# EasyEDA Pro project OpenWear Core.epro

# Schematic Schematic

## Sheets
1 Main: Create Date: 2023-09-01; Page Name: Main; Project Name: OpenWear; Schematic Name: Schematic; Update Date: 2023-11-01; Company: Zhejiang University; Drawed: AnxiousOrange; Page Size: A4; Version: V1.0
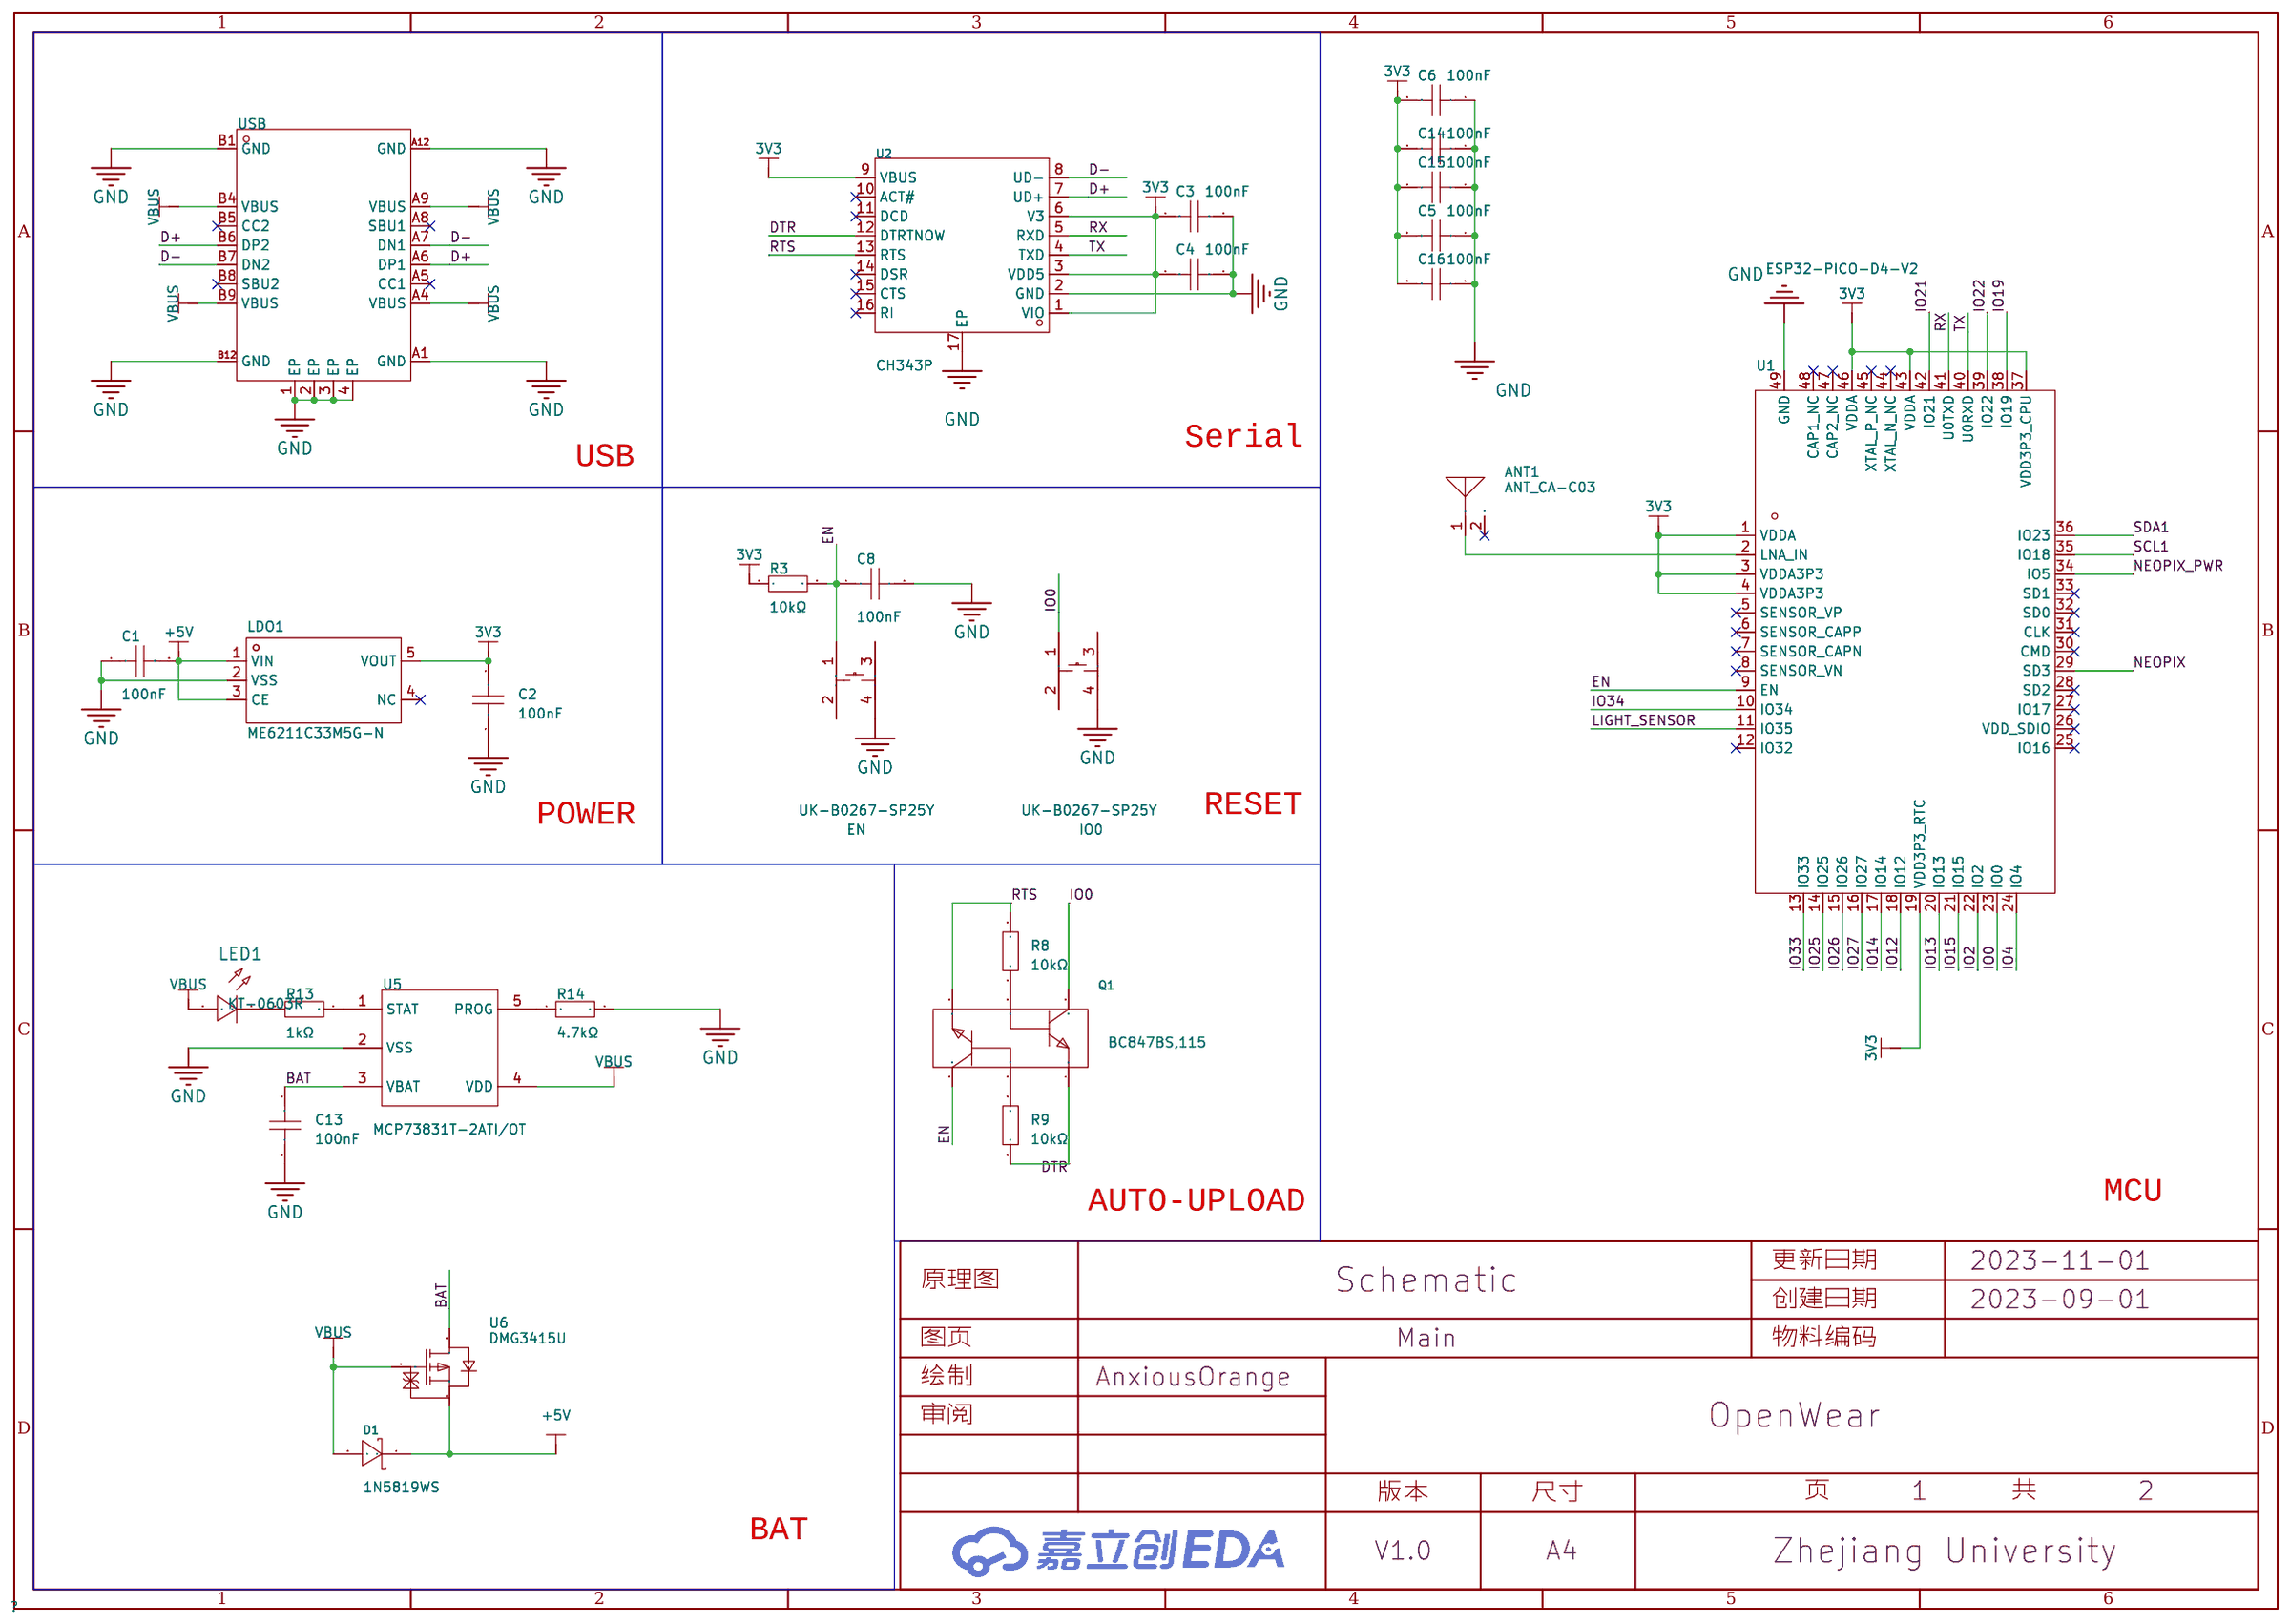
[diagram p0: Main]
2 Sensor: Create Date: 2023-09-19; Page Name: Sensor.Schematic; Update Date: 2023-10-16; Company: 嘉立创EDA
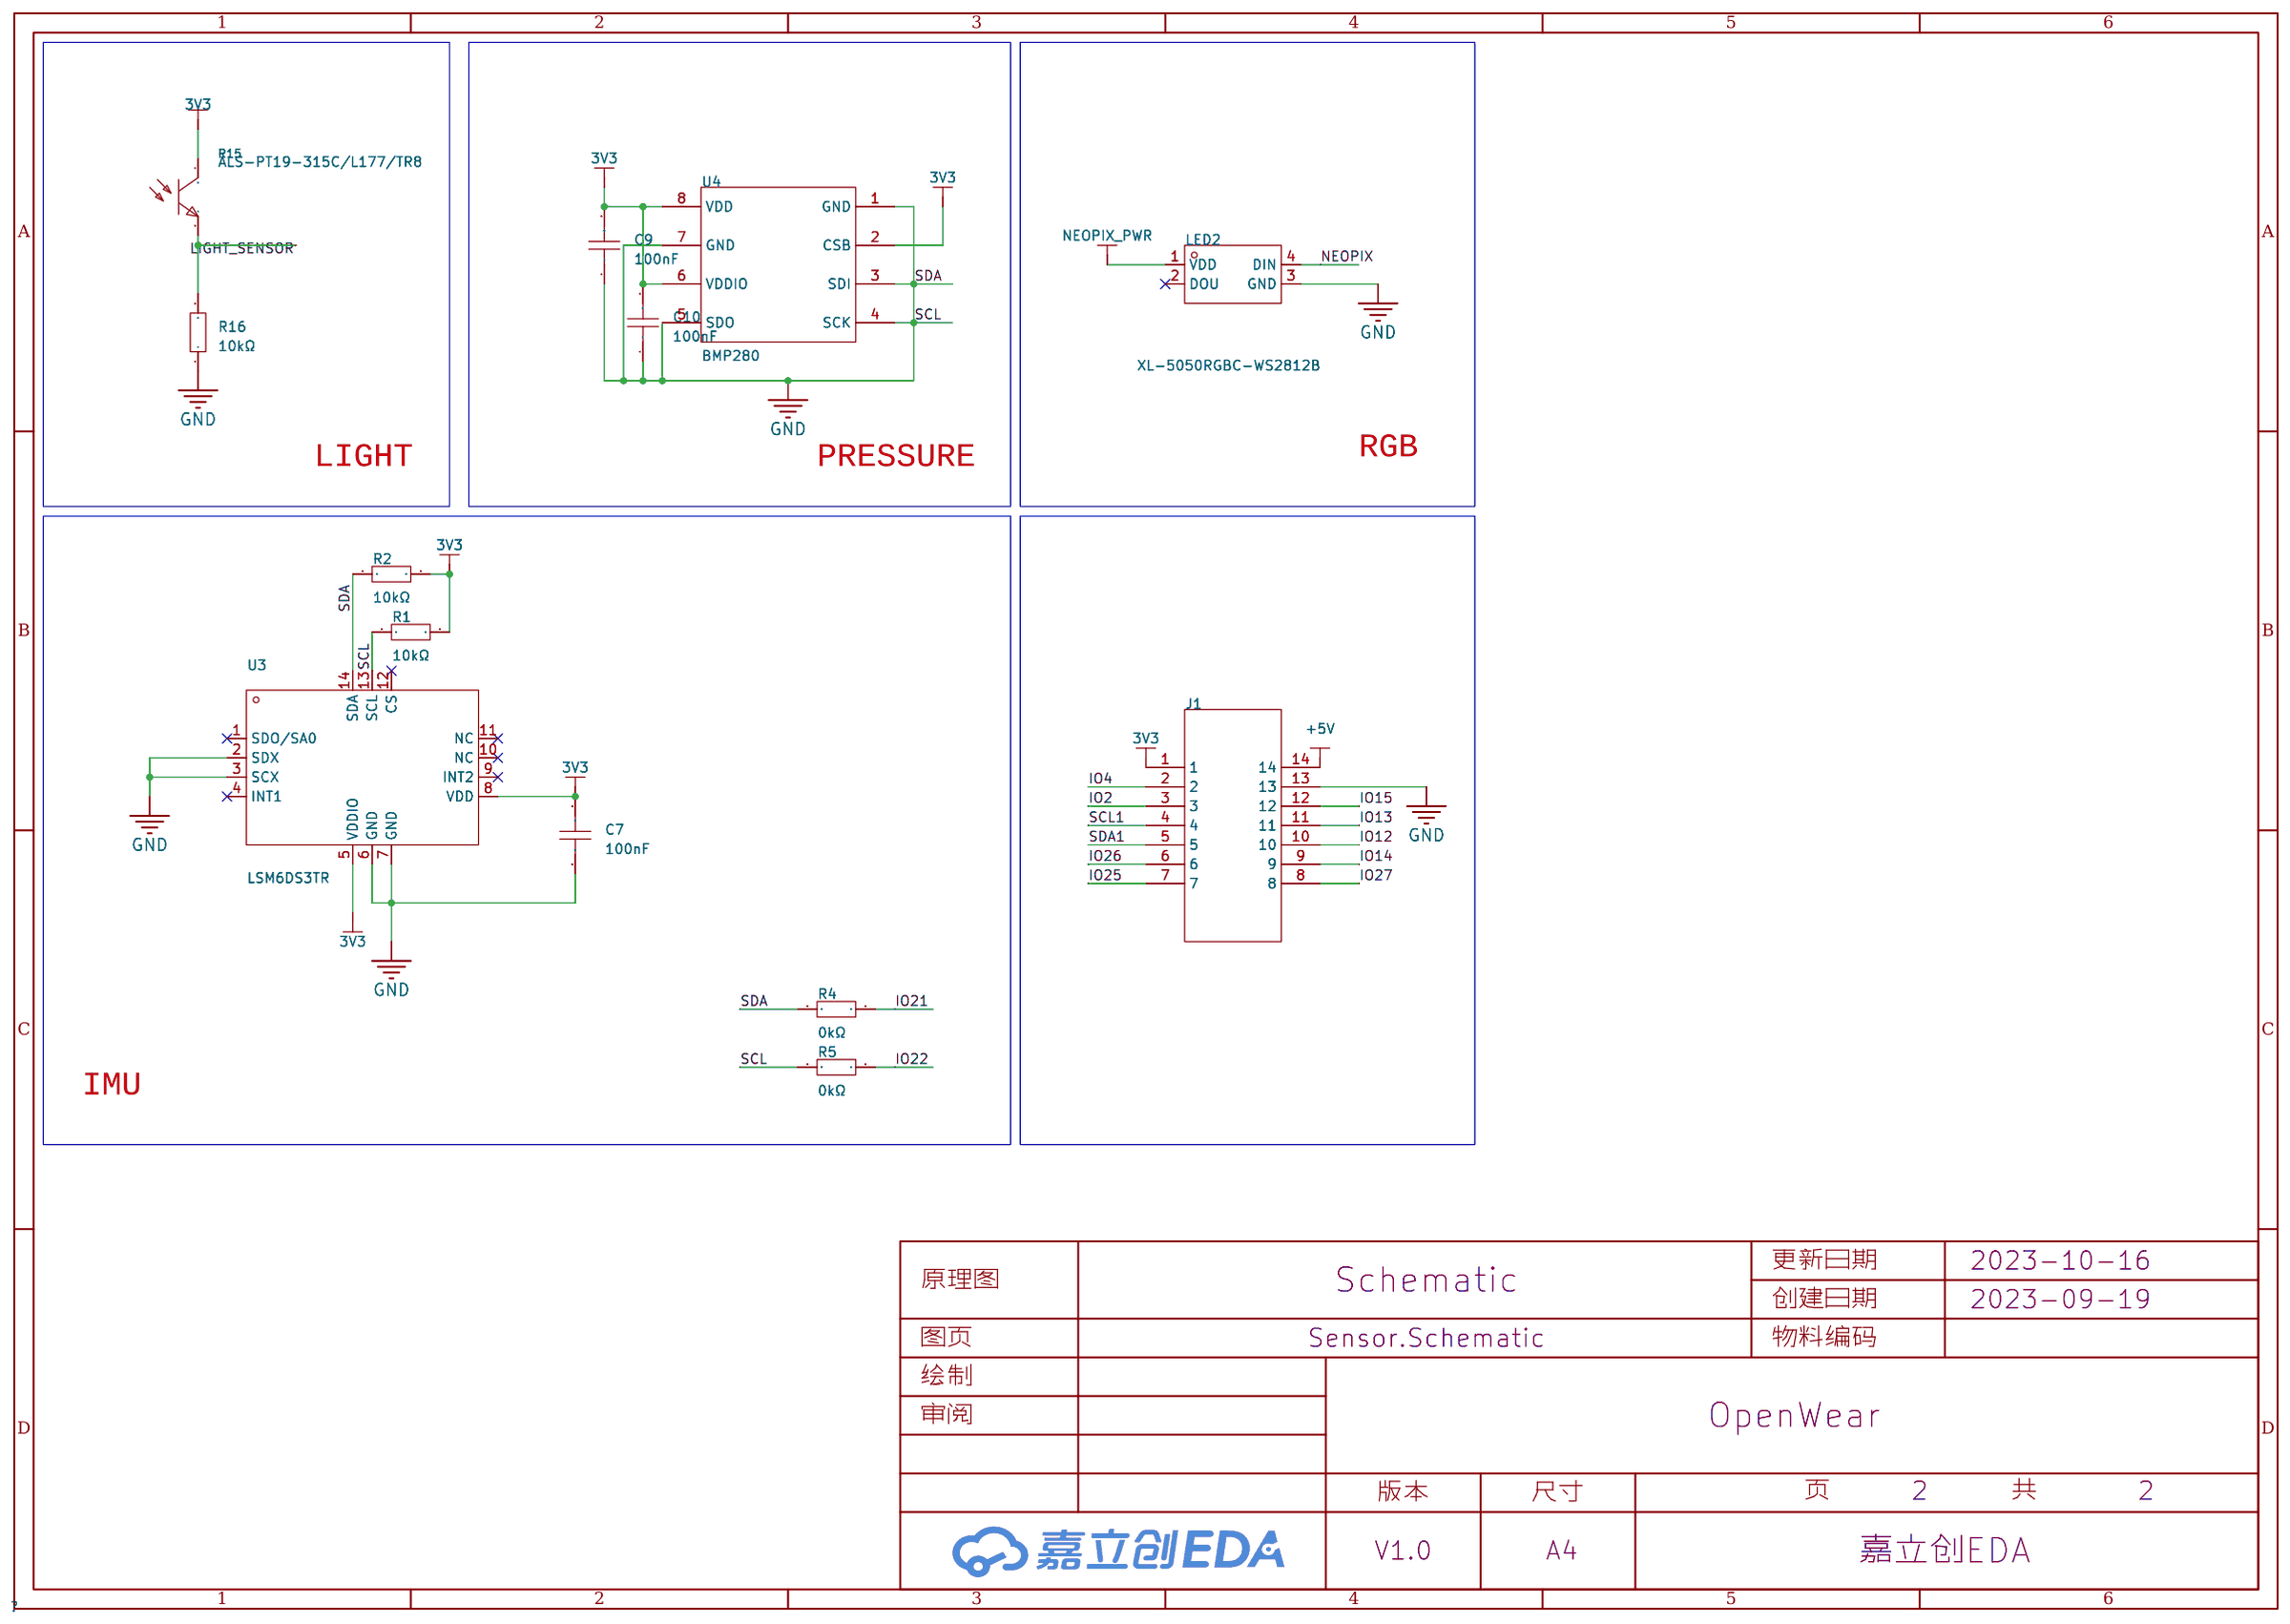
[diagram p1: Sensor]

## Parts
sheet Main
ANT1  ANT_CA-C03  [ANT-SMD_L5.5-W2.0]
C1  100nF  [C0603]
C2  100nF  [C0603]
C3  100nF  [C0603]
C4  100nF  [C0603]
C5  100nF  [C0603]
C6  100nF  [C0603]
C8  100nF  [C0603]
C13  100nF  [C0603]
C14  100nF  [C0603]
C15  100nF  [C0603]
C16  100nF  [C0603]
D1  1N5819WS  [SOD-323_L1.8-W1.3-LS2.5-RD]
EN  UK-B0267-SP25Y  [KEY-SMD_4P-L4.2-W3.2-P2.20-LS4.6]
IO0  UK-B0267-SP25Y  [KEY-SMD_4P-L4.2-W3.2-P2.20-LS4.6]
LDO1  ME6211C33M5G-N  [SOT-23-5_L3.0-W1.7-P0.95-LS2.8-BL]
LED1  KT-0603R  [LED0603-RD]
Q1  BC847BS,115  [SOT-363_L2.0-W1.3-P0.65-LS2.1-TL]
R3  10kΩ  [R0603]
R8  10kΩ  [R0603]
R9  10kΩ  [R0603]
R13  1kΩ  [R0603]
R14  4.7kΩ  [R0603]
U1  ESP32-PICO-D4-V2  [QFN-48_L7.0-W7.0-P0.50-BL-EP5.4]
U2  CH343P  [TQFN-16_L3.0-W3.0-P0.50-BL-EP1.7]
U5  MCP73831T-2ATI/OT  [SOT-23-5_L3.0-W1.7-P0.95-LS2.8-BR]
U6  DMG3415U  [SOT-23-3_L2.9-W1.3-P1.90-LS2.4-BR-1]
USB  typec  [USB-C-SMD_KH-TYPE-C-16P]
sheet Sensor
C7  100nF  [C0603]
C9  100nF  [C0603]
C10  100nF  [C0603]
J1  -  [Ring]
LED2  XL-5050RGBC-WS2812B  [LED-SMD_4P-L5.0-W5.0-BL_XL-5050RGBC]
R1  10kΩ  [R0603]
R2  10kΩ  [R0603]
R4  0kΩ  [R0603]
R5  0kΩ  [R0603]
R15  ALS-PT19-315C/L177/TR8  [SENSORS-SMD_ALS-PT19]
R16  10kΩ  [R0603]
U3  LSM6DS3TR  [LGA-14_L3.0-W2.5-P0.50-TL]
U4  BMP280  [LGA-8_L2.5-W2.0-P0.65_AMP6127]

## Library data of the parts
ANT1 = ANT_CA-C03: Supplier Part: C9900003739; Supplier Footprint: ANT-SMD_L5.5-W2.0-P5.0; JLCPCB Part Class: 扩展库; Datasheet: https://atta.szlcsc.comnull; Supplier: LCSC
C1 C2 C5-C10 C13-C16 = 0603B104K500NT: 容值:100nF;精度:±10%;额定电压:50V;材质(温度系数):X7R;; LCSC Part Name: 100nF ±10% 50V; Supplier Part: C30926; Manufacturer: FH(风华); Supplier Footprint: 0603; JLCPCB Part Class: Extended Part; Datasheet: https://atta.szlcsc.com/upload/public/pdf/source/20170923/C30926_1506149436298988724.pdf; Supplier: LCSC; Tolerance: ±10%; Voltage Rated: 50V; Temperature Coefficient: X7R
C3 C4 = CC0603KRX7R9BB104: 容值:100nF;精度:±10%;额定电压:50V;材质(温度系数):X7R;; LCSC Part Name: 100nF ±10% 50V; Supplier Part: C14663; Manufacturer: YAGEO(国巨); Supplier Footprint: 0603; JLCPCB Part Class: Basic Part; Datasheet: https://atta.szlcsc.com/upload/public/pdf/source/20180910/C282072_33301C7F631E79921B82A8DAC6BCC5B3.pdf; Supplier: LCSC; Tolerance: ±10%; Voltage Rated: 50V; Temperature Coefficient: X7R
D1 = 1N5819WS_C191023: 直流反向耐压(Vr):40V;平均整流电流(Io):1A;正向压降(Vf):600mV@1A;; LCSC Part Name: 40V 1A 600mV@1A; Supplier Part: C191023; Manufacturer: Hottech(合科泰); Supplier Footprint: SOD-323; JLCPCB Part Class: 基础库; Datasheet: https://atta.szlcsc.com/upload/public/pdf/source/20220428/3CB86FD8D28D653594B4E35F9D5AEFD9.pdf; Supplier: LCSC; Reverse Voltage (Vr): 40V; Average Rectified Current (Io): 1A; Forward Voltage (Vf@If): 600mV@1A
EN IO0 = UK-B0267-SP25Y: 触点电流:50mA;额定电压(DC):12V;绝缘电阻:100MΩ;电路结构:单刀单掷;安装方式:立贴;带灯:无;作用力:250gf@±30gf;机械寿命:10万次;带支架:否;; LCSC Part Name: 4.2*3.2*2.5mm 立贴 轻触开关; Supplier Part: C493283; Manufacturer: USAKRO(美韩); Supplier Footprint: SMD; JLCPCB Part Class: 扩展库; Datasheet: https://atta.szlcsc.com/upload/public/pdf/source/20200316/C493283_FCD60005A56EF39F29DA094EFB56EB0E.pdf; Supplier: LCSC; Contact Current: 50mA; Voltage Rating (DC): 12V; Insulation Resistance: 100MΩ; Circuit: 单刀单掷; Mounting Style: 立贴; Actuator Style: 椭圆形按钮; Actuator/Cap Color: 白色; With Lamp: 无; Operating Force: 250gf@±30gf; Mechanical Life: 10万次; Operating Temperature: -20℃~+70℃; Pin Style: J型引脚; Switch Length: 4.2mm; Switch Width: 3.2mm; Switch Height: 2.5mm; Strike Gundam: 否
LDO1 = ME6211C33M5G-N: 输出类型:固定;输出极性:正;最大输入电压:6V;输出电压:3.3V;输出电流:500mA;电源纹波抑制比(PSRR):70dB;; Supplier Part: C82942; Manufacturer: MICRONE(南京微盟); Supplier Footprint: SOT-23-5; JLCPCB Part Class: 扩展库; Datasheet: https://atta.szlcsc.com/upload/public/pdf/source/20170918/C82942_1505727073070976520.pdf; Supplier: LCSC; Output Type: 固定; Output Polarity: 正; Number of Outputs: 1; Maximum Input Voltage: 6V; Output Voltage: 3.3V; Dropout Voltage: 260mV@(200mA); Output Current: 500mA; Power Supply Rejection Ratio (PSRR): 70dB
LED1 = KT-0603R: 发光颜色:红灯;二极管配置:-;透镜颜色:-;主波长:-;色温:-;功率:-;发光角度:-;安装方式:-;工作温度:-40℃~+85℃;; LCSC Part Name: 0603 红灯 高亮; Supplier Part: C2286; Manufacturer: KENTO; Supplier Footprint: 0603; JLCPCB Part Class: Basic Part; Datasheet: https://atta.szlcsc.com/upload/public/pdf/source/20160616/1466072038404.pdf; Supplier: LCSC; Emitted Color: 红灯; Operating Temperature: -40℃~+85℃
Q1 = BC847BS,115: 晶体管类型:2个NPN;集射极击穿电压(Vceo):45V;集电极电流(Ic):100mA;功率(Pd):220mW;; LCSC Part Name: 2个NPN 45V 100mA; Supplier Part: C8653; Manufacturer: Nexperia(安世); Supplier Footprint: SOT-363; JLCPCB Part Class: 扩展库; Datasheet: 2022-07-12/264194G/031d9abe5b8c4fbda39b0baeb52377e3/BC847BS.pdf; Supplier: LCSC; Transistor Type: 2个NPN; Collector-Emitter Breakdown Voltage (Vceo): 45V; Collector Current (Ic): 100mA; Power Dissipation (Pd): 220mW
R1-R5 R8 R9 R13 R16 = 0603WAF1002T5E: 电阻类型:厚膜电阻;阻值:10kΩ;精度:±1%;功率:100mW;; LCSC Part Name: 厚膜电阻 10kΩ ±1% 100mW; Supplier Part: C25804; Manufacturer: UNI-ROYAL(厚声); Supplier Footprint: 0603; JLCPCB Part Class: Basic Part; Datasheet: https://atta.szlcsc.com/upload/public/pdf/source/20200306/C422600_1E6D84923E4A46A82E41ADD87F860B5C.pdf; Supplier: LCSC; Type: 厚膜电阻; Tolerance: ±1%; Power(Watts): 100mW; Temperature Coefficient: ±100ppm/℃; Overload Voltage (Max): 75V; Operating Temperature Range: -55℃~+155℃
R14 = 0603WAF4701T5E: 电阻类型:厚膜电阻;阻值:4.7kΩ;精度:±1%;功率:100mW;; LCSC Part Name: 4.7kΩ ±1% 100mW; Supplier Part: C23162; Manufacturer: UNI-ROYAL(厚声); Supplier Footprint: 0603; JLCPCB Part Class: Basic Part; Datasheet: https://atta.szlcsc.com/upload/public/pdf/source/20200306/C422600_1E6D84923E4A46A82E41ADD87F860B5C.pdf; Supplier: LCSC; Type: 厚膜电阻; Tolerance: ±1%; Power(Watts): 100mW; Temperature Coefficient: ±100ppm/℃; Overload Voltage (Max): 75V; Operating Temperature Range: -55℃~+155℃
U1 = ESP32-PICO-D4-V2: Supplier Part: C2832759; Supplier Footprint: QFN-48_L7.0-W7.0-P0.50; JLCPCB Part Class: 扩展库; Datasheet: 2021-05-10/246395G/59642151566b40cc9109a6a32de91243/esp32-pico-d4-v2_datasheet_en.pdf; Supplier: LCSC
U2 = CH343P: 类型:-;协议类别:-;驱动器/接收器数:-;数据速率:-;; Supplier Part: C2846043; Manufacturer: WCH(南京沁恒); Supplier Footprint: QFN-16; JLCPCB Part Class: 扩展库; Datasheet: 2021-07-07/108913S/1444e436f0ee4499a1b0f1a967f741b9/CH343DS1.PDF; Supplier: LCSC
U5 = MCP73831T-2ATI/OT: Tiny 500mA linear charge management controller.  Includes integrated pass transistor, integrated current sensing, and reverse discharge protection in 5-pin SOT-23 and thermally-efficient 8-pin 2mm x 3mm DFN packages; Supplier Part: C14879; Manufacturer: MICROCHIP(美国微芯); Supplier Footprint: SOT-23-5; JLCPCB Part Class: 扩展库; Datasheet: https://atta.szlcsc.com/upload/public/pdf/source/20140724/1457707158941.pdf; Supplier: LCSC
U6 = DMG3415U: Supplier Part: C7202986; Manufacturer: TECH PUBLIC(台舟); Supplier Footprint: SOT-23; Datasheet: https://atta.szlcsc.com/upload/public/pdf/source/20230529/58554909FE09FF38B9F41498AE71FCE8.pdf; Supplier: LCSC
USB = typec: Supplier Part: C9900016956; Supplier Footprint: typec 12p; JLCPCB Part Class: 扩展库; Supplier: LCSC
J1 = Ring
LED2 = XL-5050RGBC-WS2812B: 发光颜色:RGB三色;二极管配置:-;主波长:-;色温:-;功率:-;安装方式:正贴;; LCSC Part Name: RGB三色 正贴 幻彩; Supplier Part: C2843785; Manufacturer: XINGLIGHT(成兴光); Supplier Footprint: SMD5050; JLCPCB Part Class: 扩展库; Datasheet: https://atta.szlcsc.com/upload/public/pdf/source/20230111/86AAD2096485A2E5BCAB883FF8CBE6FD.pdf; Supplier: LCSC; Emitted Color: RGB三色; Lens Color: 无色透明; Peak Wavelength: 625nm；470nm；530nm; Viewing Angle: 120°; Mounting Sytle: 正贴; Operating Temperature: -30℃~+70℃
R15 = ALS-PT19-315C/L177/TR8: 5.5V,λp=630nm; Supplier Part: C146233; Manufacturer: EVERLIGHT(亿光); Supplier Footprint: 0603; JLCPCB Part Class: 扩展库; Datasheet: https://atta.szlcsc.com/upload/public/pdf/source/20180224/C146233_15194361392901363357.pdf; Supplier: LCSC
U3 = LSM6DS3TR: 3D 加速度计and 3D 陀螺仪3D accelerometer and 3D gyroscope; LCSC Part Name: LSM6DS3TR MSL=3; Supplier Part: C95230; Manufacturer: ST(意法半导体); Supplier Footprint: LGA-14L; JLCPCB Part Class: 扩展库; Datasheet: https://atta.szlcsc.com/upload/public/pdf/source/20180410/C95230_E9546B888C12D8CC6F7F231B3BE24882.pdf; Supplier: LCSC
U4 = BMP280: Bosch气压传感器新品，可测量大气压力，带高精度温度测量，可校准精确计算海拔高度。I2C或SPI接口，宽量程（300-1100hpa），精度高; Supplier Part: C83291; Manufacturer: Bosch(博世); Supplier Footprint: LGA-8(2x2.5); JLCPCB Part Class: 扩展库; Datasheet: https://atta.szlcsc.com/upload/public/pdf/source/20200702/C83291_F39E84AB7DFC569A4C7554F8659640A1.pdf; Supplier: LCSC

## Nets
3V3: C2.2 C3.1 C4.1 C5.2 C6.2 C7.1 C9.2 C10.2 C14.2 C15.2 C16.2 J1.1 LDO1.5(VOUT) R1.2 R2.2 R3.1 R15.1(C) U1.1(VDDA) U1.3(VDDA3P3) U1.4(VDDA3P3) U1.19(VDD3P3_RTC) U1.37(VDD3P3_CPU) U1.43(VDDA) U1.46(VDDA) U2.1(VIO) U2.3(VDD5) U2.6(V3) U2.9(VBUS) U3.5(VDDIO) U3.8(VDD) U4.2(CSB) U4.6(VDDIO) U4.8(VDD)
+5V: C1.2 D1.1(K) J1.14 LDO1.1(VIN) LDO1.3(CE) U6.2(S)
GND: C1.1 C2.1 C3.2 C4.2 C5.1 C6.1 C7.2 C8.2 C9.1 C10.1 C13.1 C14.1 C15.1 C16.1 EN.4 IO0.4 J1.13 LDO1.2(VSS) LED2.3(GND) R14.2 R16.1 U1.49(GND) U2.2(GND) U2.17(EP) U3.2(SDX) U3.3(SCX) U3.6(GND) U3.7(GND) U4.1(GND) U4.5(SDO) U4.7(GND) U5.2(VSS) USB.1(EP) USB.2(EP) USB.3(EP) USB.4(EP) USB.A1(GND) USB.A12(GND) USB.B1(GND) USB.B12(GND)
VBUS: D1.2(A) LED1.2(A) U5.4(VDD) U6.1(G) USB.A4(VBUS) USB.A9(VBUS) USB.B4(VBUS) USB.B9(VBUS)
BAT: C13.2 U5.3(VBAT) U6.3(D)
D+: U2.7(UD+) USB.A6(DP1) USB.B6(DP2)
D-: U2.8(UD-) USB.A7(DN1) USB.B7(DN2)
DTR: Q1.4 R9.1 U2.12(DTRTNOW)
EN: C8.1 EN.1 Q1.6 R3.2 U1.9(EN)
IO0: IO0.1 Q1.3 U1.23(IO0)
IO2: J1.3 U1.22(IO2)
IO4: J1.2 U1.24(IO4)
IO12: J1.10 U1.18(IO12)
IO13: J1.11 U1.20(IO13)
IO14: J1.9 U1.17(IO14)
IO15: J1.12 U1.21(IO15)
IO19: U1.38(IO19)
IO21: R4.1 U1.42(IO21)
IO22: R5.1 U1.39(IO22)
IO25: J1.7 U1.14(IO25)
IO26: J1.6 U1.15(IO26)
IO27: J1.8 U1.16(IO27)
IO33: U1.13(IO33)
IO34: U1.10(IO34)
LIGHT_SENSOR: R15.2(E) R16.2 U1.11(IO35)
NEOPIX: LED2.4(DIN) U1.29(SD3)
NEOPIX_PWR: LED2.1(VDD) U1.34(IO5)
RTS: Q1.1 R8.2 U2.13(RTS)
RX: U1.41(U0TXD) U2.5(RXD)
SCL: R1.1 R5.2 U3.13(SCL) U4.4(SCK)
SCL1: J1.4 U1.35(IO18)
SDA: R2.1 R4.2 U3.14(SDA) U4.3(SDI)
SDA1: J1.5 U1.36(IO23)
TX: U1.40(U0RXD) U2.4(TXD)
$1N15628: Q1.5 R8.1
$1N15680: Q1.2 R9.2
$1N17086: ANT1.1 U1.2(LNA_IN)
$1N22484: R13.2 U5.1(STAT)
$1N22485: LED1.1(C) R13.1
$1N22486: R14.1 U5.5(PROG)

Not connected (* = marked no-connect by the designer): ANT1 2(NC)*; EN 2 3; IO0 2 3; LDO1 4(NC)*; LED2 2(DOU)*; U1 5(SENSOR_VP)* 6(SENSOR_CAPP)* 7(SENSOR_CAPN)* 8(SENSOR_VN)* 12(IO32)* 25(IO16)* 26(VDD_SDIO)* 27(IO17)* 28(SD2)* 30(CMD)* 31(CLK)* 32(SD0)* 33(SD1)* 44(XTAL_N_NC)* 45(XTAL_P_NC)* 47(CAP2_NC)* 48(CAP1_NC)*; U2 10(ACT#)* 11(DCD)* 14(DSR)* 15(CTS)* 16(RI)*; U3 1(SDO/SA0)* 4(INT1)* 9(INT2)* 10(NC)* 11(NC)* 12(CS)*; USB A5(CC1)* A8(SBU1)* B5(CC2)* B8(SBU2)*

## Notes on the sheets
sheet 1
- Serial
- USB
- POWER
- RESET
- MCU
- AUTO-UPLOAD
- BAT
sheet 2
- LIGHT
- PRESSURE
- RGB
- IMU

# Board PCB
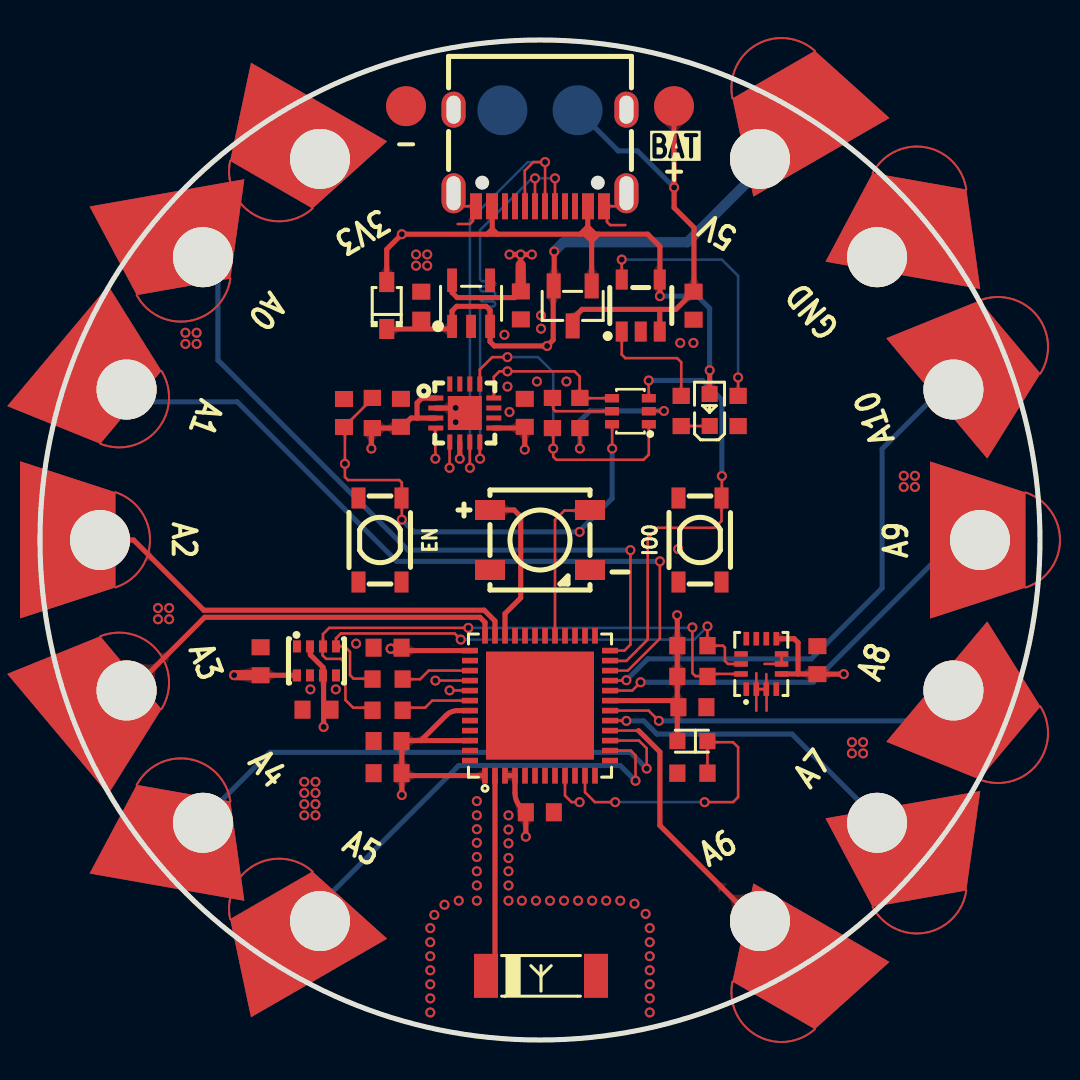
[diagram p2: board, top side]
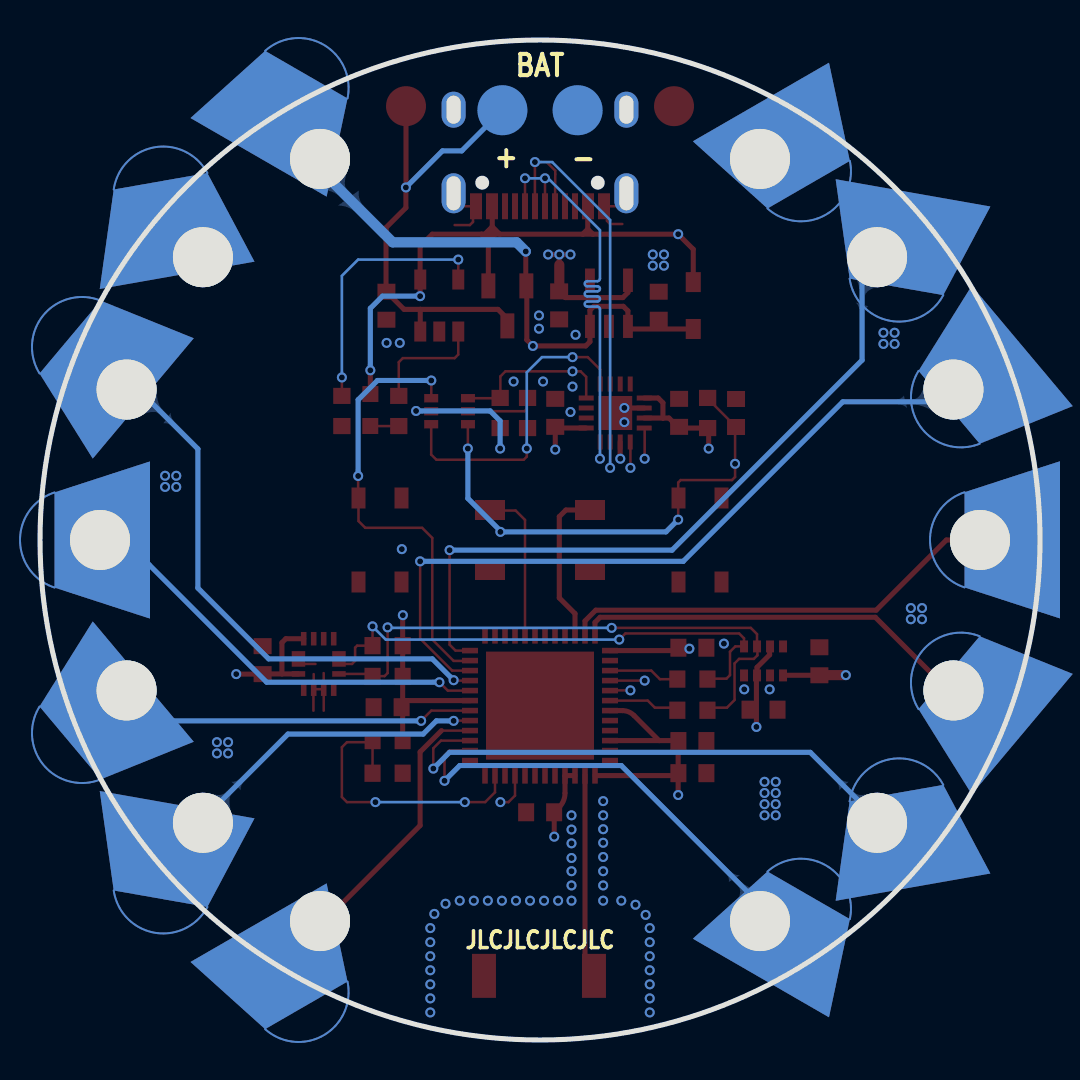
[diagram p3: board, bottom side, seen from below]

Outline 50 x 50 mm; copper layers: Top Layer, Inner1, Inner2, Bottom Layer. Coordinates in mm from the lower left corner of the outline.
Outline path: circle c25,25 r25
Stack: Top Layer 0.035mm 外层铜厚1oz / Dielectric1 0.28mm 7628 RC49% 8.6mil / Inner1 0.035mm 内层铜厚 / Dielectric2 0.28mm 1.1mm H/HOZ 含铜 / Inner2 0.035mm 内层铜厚 / Dielectric3 0.28mm 7628 RC49% 8.6mil / Bottom Layer 0.035mm 外层铜厚1oz

## Design rules (mm)
net TX: DP2
net RX: DP2
net D+: DP1
net D-: DP1
template: 自定义配置
spacing copperThickness1oz (default): track to track 0.102, other pairs 0.152 to 0.3
spacing copperThickness2oz: track to track 0.203, other pairs 0.152 to 0.3
track width copperThickness1oz (default): min 0.127, default 0.127, max 2.54
track width copperThickness2oz: min 0.203, default 0.254, max 2.54
track width PWR: min 0.254, default 0.508, max 2.54
differential pair differentialPair (default): width min 0.127, default 0.254, max 2.54; gap min 0.152, default 0.152
via viaSize (default): diameter min 0.5, default 0.61, max 10; hole min 0.3, default 0.305, max 6.299
net +5V uses PWR
net 3V3 uses PWR
net VBUS uses PWR
pour e639 uses copperRegion

## Placement (name value [footprint] x y rotation side)
ANT1  ANT_CA-C03  [ANT-SMD_L5.5-W2.0]  25.05 3.21 0 top
C1  100nF  [C0603]  19.06 36.72 270 top
C2  100nF  [C0603]  24.04 36.73 90 top
C3  100nF  [C0603]  18.05 31.36 90 top
C4  100nF  [C0603]  24.24 31.36 90 top
C5  100nF  [C0603]  32.62 16.64 180 top
C6  100nF  [C0603]  17.38 13.34 0 top
C7  100nF  [C0603]  38.87 18.99 90 top
C8  100nF  [C0603]  15.2 31.35 90 top
C9  100nF  [C0603]  11.03 18.94 270 top
C10  100nF  [C0603]  13.82 16.52 0 top
C13  100nF  [C0603]  32.68 36.72 90 top
C14  100nF  [C0603]  24.99 11.39 180 top
C15  100nF  [C0603]  17.38 19.61 0 top
C16  100nF  [C0603]  17.38 14.95 0 top
D1  1N5819WS  [SOD-323_L1.8-W1.3-LS2.5-RD]  17.34 36.72 90 top
EN  UK-B0267-SP25Y  [KEY-SMD_4P-L4.2-W3.2-P2.20-LS4.6]  17 25 270 top
IO0  UK-B0267-SP25Y  [KEY-SMD_4P-L4.2-W3.2-P2.20-LS4.6]  33 25 270 top
J1  -  [Ring]  25 25 0 top
LDO1  ME6211C33M5G-N  [SOT-23-5_L3.0-W1.7-P0.95-LS2.8-BL]  21.55 36.83 0 top
LED1  KT-0603R  [LED0603-RD]  33.48 31.5 90 top
LED2  XL-5050RGBC-WS2812B  [LED-SMD_4P-L5.0-W5.0-BL_XL-5050RGBC]  25 25 270 top
NOREF  -  [Pad_e3104]  18.3 46.69 270 top
NOREF#2  -  [Pad_e6]  23.12 46.49 270 top
NOREF#3  -  [Pad_e2]  26.88 46.49 270 top
NOREF#4  -  [Pad_e3105]  31.7 46.69 270 top
Q1  BC847BS,115  [SOT-363_L2.0-W1.3-P0.65-LS2.1-TL]  29.52 31.44 180 top
R1  10kΩ  [R0603]  32.62 19.72 180 top
R2  10kΩ  [R0603]  32.62 18.18 180 top
R3  10kΩ  [R0603]  16.62 31.35 90 top
R4  0kΩ  [R0603]  17.38 16.49 180 top
R5  0kΩ  [R0603]  17.38 18.05 180 top
R8  10kΩ  [R0603]  25.62 31.35 270 top
R9  10kΩ  [R0603]  26.99 31.35 270 top
R13  1kΩ  [R0603]  32.06 31.45 90 top
R14  4.7kΩ  [R0603]  34.91 31.45 270 top
R15  ALS-PT19-315C/L177/TR8  [SENSORS-SMD_ALS-PT19]  32.62 14.94 0 top
R16  10kΩ  [R0603]  32.62 13.34 0 top
U1  ESP32-PICO-D4-V2  [QFN-48_L7.0-W7.0-P0.50-BL-EP5.4]  25 16.72 0 top
U2  CH343P  [TQFN-16_L3.0-W3.0-P0.50-BL-EP1.7]  21.24 31.35 270 top
U3  LSM6DS3TR  [LGA-14_L3.0-W2.5-P0.50-TL]  36.07 18.8 90 top
U4  BMP280  [LGA-8_L2.5-W2.0-P0.65_AMP6127]  13.82 18.95 90 top
U5  MCP73831T-2ATI/OT  [SOT-23-5_L3.0-W1.7-P0.95-LS2.8-BR]  30.04 36.72 270 top
U6  DMG3415U  [SOT-23-3_L2.9-W1.3-P1.90-LS2.4-BR-1]  26.63 36.71 90 top
USB  typec  [USB-C-SMD_KH-TYPE-C-16P]  25 44.1 180 top

## Footprints (pads in the part's own frame, mm; a bottom-side part is the same pattern mirrored in y, then rotated)
ANT-SMD_L5.5-W2.0
  rect 1.2x2.2 smd: 1(-2.75,0) 2(2.75,0)
C0603
  rect 0.8x0.9 smd: 1(-0.7,0) 2(0.7,0)
KEY-SMD_4P-L4.2-W3.2-P2.20-LS4.6
  rect 1.05x0.7 smd: 1(-2.1,1.075) 2(2.1,1.075) 3(-2.1,-1.075) 4(2.1,-1.075)
LED0603-RD
  rect 0.8x0.8 smd: 1(-0.799,-0.004) 2(0.799,0.004)
LED-SMD_4P-L5.0-W5.0-BL_XL-5050RGBC
  rect 1x1.5 smd: 1(-1.5,-2.5) 2(1.5,-2.5) 3(1.5,2.5) 4(-1.5,2.5)
LGA-8_L2.5-W2.0-P0.65_AMP6127
  rect 0.6x0.4 smd: 1(0.725,0.975) 2(0.725,0.325) 3(0.725,-0.325) 4(0.725,-0.975) 5(-0.725,-0.975) 6(-0.725,-0.325) 7(-0.725,0.325) 8(-0.725,0.975)
LGA-14_L3.0-W2.5-P0.50-TL
  rect 0.675x0.28 smd: 1(-1.262,0.75) 2(-1.262,0.25) 3(-1.262,-0.25) 4(-1.262,-0.75) 8(1.262,-0.75) 9(1.262,-0.25) 10(1.262,0.25) 11(1.262,0.75)
  rect 0.28x0.675 smd: 5(-0.5,-1.012) 6(0,-1.012) 7(0.5,-1.012) 12(0.5,1.012) 13(0,1.012) 14(-0.5,1.012)
Pad_e2
  round 2.5 smd far side: 2(0,0)
Pad_e6
  round 2.5 smd far side: 1(0,0)
Pad_e3104
  round 2 smd: 1(0,0)
Pad_e3105
  round 2 smd: 2(0,0)
QFN-48_L7.0-W7.0-P0.50-BL-EP5.4
  rect 0.28x0.8 smd: 1(-2.75,-3.5) 2(-2.25,-3.5) 3(-1.75,-3.5) 4(-1.25,-3.5) 5(-0.75,-3.5) 6(-0.25,-3.5) 7(0.25,-3.5) 8(0.75,-3.5) 9(1.25,-3.5) 10(1.75,-3.5) 11(2.25,-3.5) 12(2.75,-3.5) 25(2.75,3.5) 26(2.25,3.5) 27(1.75,3.5) 28(1.25,3.5) 29(0.75,3.5) 30(0.25,3.5) 31(-0.25,3.5) 32(-0.75,3.5) 33(-1.25,3.5) 34(-1.75,3.5) 35(-2.25,3.5) 36(-2.75,3.5)
  rect 0.8x0.28 smd: 13(3.5,-2.75) 14(3.5,-2.25) 15(3.5,-1.75) 16(3.5,-1.25) 17(3.5,-0.75) 18(3.5,-0.25) 19(3.5,0.25) 20(3.5,0.75) 21(3.5,1.25) 22(3.5,1.75) 23(3.5,2.25) 24(3.5,2.75) 37(-3.5,2.75) 38(-3.5,2.25) 39(-3.5,1.75) 40(-3.5,1.25) 41(-3.5,0.75) 42(-3.5,0.25) 43(-3.5,-0.25) 44(-3.5,-0.75) 45(-3.5,-1.25) 46(-3.5,-1.75) 47(-3.5,-2.25) 48(-3.5,-2.75)
  rect 5.4x5.4 smd: 49(0,0)
R0603
  rect 0.806x0.864 smd: 1(-0.753,0) 2(0.753,0)
Ring
  custom 7.902x7.929 hole 0.003 rot 120: 1(-12.559,20.517) 8(12.559,-20.517)
  round 3 hole 3: 1(-11,19.052) 2(-16.853,14.142) 3(-20.673,7.524) 4(-22,0) 5(-20.673,-7.524) 6(-16.853,-14.142) 7(-11,-19.052) 8(11,-19.052) 9(16.853,-14.142) 10(20.673,-7.524) 11(22,0) 12(20.673,7.524) 13(16.853,14.142) 14(11,19.052)
  custom 8.089x8.08 hole 0.003 rot 140: 2(-18.398,15.296) 9(18.398,-15.296)
  custom 7.602x7.56 hole 0.003 rot 160: 3(-21.974,8.391) 10(21.974,-8.391)
  custom 6.5x7.857 hole 0.003: 4(-22.75,0.009) 11(22.75,0)
  custom 7.602x7.56 hole 0.003 rot 20: 5(-21.974,-8.391) 12(21.974,8.391)
  custom 8.089x8.08 hole 0.003 rot 40: 6(-18.398,-15.296) 13(18.398,15.296)
  custom 7.902x7.929 hole 0.003 rot 60: 7(-12.559,-20.517) 14(12.559,20.517)
SENSORS-SMD_ALS-PT19
  rect 0.8x0.8 smd: 1(-0.75,0) 2(0.75,0)
SOD-323_L1.8-W1.3-LS2.5-RD
  rect 1x0.75 smd: 1(-1.173,0) 2(1.173,0)
SOT-23-3_L2.9-W1.3-P1.90-LS2.4-BR-1
  rect 1.25x0.7 smd: 1(1,-0.95) 2(1,0.95) 3(-1,0)
SOT-23-5_L3.0-W1.7-P0.95-LS2.8-BL
  rect 0.49x1.157 smd: 1(-0.95,-1.153) 2(0,-1.153) 3(0.95,-1.153)
  rect 0.49x1.175 smd: 4(0.95,1.153) 5(-0.95,1.153)
SOT-23-5_L3.0-W1.7-P0.95-LS2.8-BR
  rect 1x0.6 smd: 1(1.3,-0.95) 2(1.3,0) 3(1.3,0.95) 4(-1.3,0.95) 5(-1.3,-0.95)
SOT-363_L2.0-W1.3-P0.65-LS2.1-TL
  rect 0.7x0.42 smd: 1(-0.92,0.65) 2(-0.92,0) 3(-0.92,-0.65) 4(0.92,-0.65) 5(0.92,0) 6(0.92,0.65)
TQFN-16_L3.0-W3.0-P0.50-BL-EP1.7
  rect 0.25x0.75 smd: 1(-0.749,-1.45) 2(-0.248,-1.45) 3(0.252,-1.45) 4(0.751,-1.45) 9(0.75,1.45) 10(0.25,1.45) 11(-0.25,1.45) 12(-0.749,1.45)
  rect 0.75x0.25 smd: 5(1.45,-0.75) 6(1.45,-0.25) 7(1.45,0.25) 8(1.45,0.75) 13(-1.45,0.75) 14(-1.45,0.25) 15(-1.45,-0.25) 16(-1.45,-0.75)
  rect 1.7x1.7 smd: 17(0.001,0)
USB-C-SMD_KH-TYPE-C-16P
  oval 1.2x2 hole 0.7x1.7: 1(-4.32,1.765) 2(4.32,1.765)
  oval 1.2x1.8 hole 0.7x1.4: 3(-4.32,-2.415) 4(4.32,-2.415)
  rect 0.3x1.3 smd: A1(-3.35,2.415) A4(-2.55,2.415) A5(-1.25,2.415) A6(-0.25,2.415) A7(0.25,2.415) A8(1.25,2.415) A9(2.55,2.415) A12(3.35,2.415) B1(3.05,2.415) B4(2.25,2.415) B5(1.75,2.415) B6(0.75,2.415) B7(-0.75,2.415) B8(-1.75,2.415) B9(-2.25,2.415) B12(-3.05,2.415)

## Nets
As in the schematic, except:
GND: C1.1 C2.1 C3.2 C4.2 C5.1 C6.1 C7.2 C8.2 C9.1 C10.1 C13.1 C14.1 C15.1 C16.1 EN.4 IO0.4 J1.13 LDO1.2 LED2.3 NOREF.1 NOREF#2.1 R14.2 R16.1 U1.49 U2.2 U2.17 U3.2 U3.3 U3.6 U3.7 U4.1 U4.5 U4.7 U5.2 USB.1 USB.2 USB.3 USB.4 USB.A1 USB.A12 USB.B1 USB.B12
BAT: C13.2 NOREF#3.2 NOREF#4.2 U5.3 U6.3

Pads without a net: ANT1 2; EN 2 3; IO0 2 3; LDO1 4; LED2 2; U1 5 6 7 8 12 25 26 27 28 30 31 32 33 44 45 47 48; U2 10 11 14 15 16; U3 1 4 9 10 11 12; USB A5 A8 B5 B8

## Via types
v1: diameter 0.5, hole 0.299, Top Layer to Bottom Layer, 141 vias

## Routing (per net, layer and track width the routed paths; a pad name or vN(x,y) marks a point on that pad's centre or on a via; arc(x,y) is an arc through that point)
3V3: length 72.9
  Top Layer w0.254: v1(20.99,29.06) 20.99,29.07 U2.6 ; v1(24.04,39.28) 24.04,38.76 ; v1(24.04,39.28) v1(24.59,39.28) ; v1(24.04,39.28) v1(23.48,39.28) ; 18.09,13.36 18.08,13.37 18.09,13.38 ; 18.09,13.36 18.09,13.38 ; 18.09,13.36 18.23,13.22 U1.1 ; 18.09,13.36 v1(18.09,12.25) ; 31.87,16.97 U1.19 ; 31.87,16.97 31.87,14.94 R15.1 ; 31.87,16.97 R2.2 R1.2 31.87,21.23 v1(31.86,21.24) ; U3.5 37.9,18.3 ; 37.9,18.3 37.9,19.87 37.71,20.06 U3.8 ; 37.9,18.3 38.86,18.3 C7.1 ; 18.85,31.1 18.55,31.1 18.15,30.69 18.05,30.69 ; 18.85,31.1 18.85,31.1 18.85,31.86 19.09,32.1 U2.1 ; 18.85,31.1 U2.3 ; U1.37 17.86,19.47 17.86,19.61 C15.2 ; 18.09,13.38 18.09,14.95 ; v1(24.24,29.52) C4.1 24.18,30.6 U2.9 ; 18.09,14.95 18.11,14.97 19.04,14.97 ; 18.09,14.95 18.08,14.94 ; U1.3 U1.4 23.75,12.35 arc(23.83,11.96) 24.05,11.63 C14.2 24.29,11.39 24.29,10.22 ; 24.04,37.44 C2.2 23.73,37.12 20.86,37.12 20.6,37.37 LDO1.5 ; 12.85,18.23 12.84,18.24 C9.2 ; U4.2 13.52,19.66 13.52,19.26 14.15,18.63 U4.6 ; 19.04,14.97 20.3,16.23 arc(20.57,16.41) 20.89,16.47 U1.43 ; 19.04,14.97 U1.46 ; v1(14.18,15.65) 14.18,18.29 ; 17.98,30.6 R3.1 16.57,30.55 v1(16.57,29.57) ; 38.92,18.29 v1(40.19,18.29)
  Top Layer w0.508: 24.04,37.43 24.04,38.76 ; C15.2 18.03,19.56 v1(17.53,19.56) ; v1(9.71,18.24) 10.94,18.24 10.99,18.19 C9.2
  Inner2 w0.254: 16.06,41.61 14,43.67 J1.1 ; J1.1 15.52,45.57 17.58,45.57 ; J1.1 12.66,42.71 12.66,40.85
  vias: v1(24.29,10.17)
+5V: length 29.7
  Top Layer w0.254: 25.71,37.7 v1(25.71,39.43) ; U6.2 25.66,37.68 25.66,35.01 v1(25.36,34.7) 22.71,34.7 22.5,34.91 LDO1.3 22.5,36.49 22.31,36.68 20.83,36.68 20.6,36.45 LDO1.1 20.47,35.55 D1.1
  Bottom Layer w0.508: 36.75,45.35 36.75,44.27 32.37,39.88 26.17,39.88 v1(25.71,39.43)
GND: length 13.6
  Top Layer w0.127: U3.2 35.82,16.47 ; U3.2 U3.3 ; U3.2 35.82,18.34 ; 20.89,40.8 21.5,40.8 21.65,40.95 USB.A12 20.68,41.69 USB.2 ; U3.3 36.33,17.53 36.33,16.47 ; U3.3 36.32,18.29 ; USB.1 29.32,41.77 29.24,41.69 USB.A1 28.35,40.9 28.51,40.75 29.27,40.75 ; U3.7 U3.6 36.23,18.8
  Top Layer w0.254: U2.2 20.99,31.6 U2.17
  vias: v1(5.9,21.6) v1(5.9,21.04) v1(6.46,21.6) v1(6.46,21.04) v1(7.27,35.36) v1(7.27,34.8) v1(7.83,35.36) v1(7.83,34.8) v1(13.21,12.91) v1(13.21,12.35) v1(13.21,11.79) v1(13.21,11.23) v1(13.52,17.53) v1(13.77,12.91) v1(13.77,12.35) v1(13.77,11.79) v1(13.77,11.23) v1(14.79,17.53) v1(15.81,19.82) v1(18.8,39.28) v1(18.8,38.72) v1(19.36,39.28) v1(19.36,38.72) v1(19.51,5.59) v1(19.51,4.89) v1(19.51,4.19) v1(19.51,3.49) v1(19.51,2.78) v1(19.51,2.08) v1(19.51,1.38) v1(19.72,6.25) v1(20.23,6.76) v1(20.78,31.6) v1(20.78,30.89) v1(20.94,6.97) v1(21.84,11.94) v1(21.84,11.23) v1(21.84,10.54) v1(21.84,9.86) v1(21.84,9.15) v1(21.84,8.44) v1(21.84,7.73) v1(21.84,6.97) v1(23.22,35.26) v1(23.38,32.67) v1(23.43,11.23) v1(23.43,10.52) v1(23.43,9.83) v1(23.43,9.1) v1(23.43,8.44) v1(23.43,7.73) v1(23.43,6.97) v1(23.48,31.4) v1(24.09,6.97) v1(24.85,32.92) v1(24.8,6.97) v1(25.05,36.23) v1(25.05,35.57) v1(25.5,6.97) v1(26.2,6.97) v1(26.32,32.92) v1(26.91,6.97) v1(27.61,6.97) v1(28.31,6.97) v1(29.01,6.97) v1(29.72,6.81) v1(30.28,6.31) v1(30.49,5.59) v1(30.49,4.89) v1(30.49,4.19) v1(30.49,3.49) v1(30.49,2.78) v1(30.49,2.08) v1(30.49,1.38) v1(31.91,24.54) v1(32.01,34.86) v1(32.67,34.86) v1(40.6,14.89) v1(40.6,14.33) v1(41.16,14.89) v1(41.16,14.33) v1(43.19,28.21) v1(43.19,27.65) v1(43.75,28.21) v1(43.75,27.65)
VBUS: length 33
  Top Layer w0.254: 27.58,39.95 27.92,40.29 ; 27.58,39.95 27.25,40.29 ; 27.58,39.95 27.58,40.29 ; 27.58,39.95 U6.1 ; 27.92,40.29 30.39,40.29 30.99,39.68 30.99,38.03 ; 27.92,40.29 27.76,40.29 ; 27.25,40.29 27.02,40.29 ; 27.25,40.29 27.39,40.29 ; 27.02,40.29 22.87,40.29 ; 27.02,40.29 27.39,40.66 ; 27.39,40.29 27.58,40.29 ; 27.39,40.29 27.39,40.66 ; 27.58,40.29 27.76,40.29 ; 27.39,41.55 27.39,40.66 ; 27.39,40.66 27.76,40.29 ; 30.99,38.03 v1(30.99,37.19) ; 30.99,38.03 U5.4 ; 22.36,40.29 22.61,40.55 ; 22.36,40.29 22.87,40.29 ; 22.36,40.29 v1(18.09,40.29) 17.34,39.54 D1.2 ; 22.61,40.55 22.61,41.55 ; 22.61,40.55 22.87,40.29 ; 33.49,32.25 33.48,32.25 v1(33.48,33.48)
  Bottom Layer w0.254: v1(30.99,37.19) 32.87,37.19 33.48,36.58 v1(33.48,33.48)
BAT: length 24.2
  Top Layer w0.254: NOREF#4.2 31.7,42.63 v1(31.71,42.63) 31.71,41.61 32.7,40.62 32.7,37.43 C13.2 31.8,36.53 30.98,36.53 ; U6.3 26.63,36.06 27.1,36.53 30.98,36.53 ; 30.98,36.53 30.99,36.53 30.99,35.42
  Bottom Layer w0.254: v1(31.71,42.63) 29.88,44.46 28.91,44.46 NOREF#3.2
D+: length 23.8
  Top Layer w0.127: U2.7 21.49,28.61 v1(21.5,28.61) ; USB.A6 25.25,41.69 v1(25.25,43.9) 24.67,43.9 24.24,43.47 24.24,43.29 arc(24.25,42.49) USB.B6
  Bottom Layer w0.127: v1(21.5,28.61) 21.5,41 24.39,43.9 v1(25.25,43.9)
D-: length 23.8
  Top Layer w0.127: USB.B7 v1(25.75,43.08) ; USB.A7 v1(24.75,43.08) ; U2.8 21.99,29.07 22,29.06
  Bottom Layer w0.127: v1(22,29.06) 22,36.54 arc(22.04,36.63) 22.13,36.67 22.64,36.67 arc(22.77,36.8) 22.64,36.93 22.13,36.93 arc(22,37.05) 22.13,37.18 22.64,37.18 arc(22.77,37.31) 22.64,37.43 22.13,37.43 arc(22,37.56) 22.13,37.69 22.64,37.69 arc(22.77,37.81) 22.64,37.94 22.13,37.94 arc(22.04,37.98) 22,38.07 22,40.49 24.59,43.08 v1(24.75,43.08) v1(25.75,43.08)
DTR: length 8.3
  Top Layer w0.127: 22.69,32.1 22.69,33.16 22.97,33.43 v1(23.38,33.43) 26.73,33.43 26.98,33.18 26.98,32.12 R9.1 27.01,32.09 28.6,32.09
EN: length 40
  Top Layer w0.127: U1.9 26.25,12.22 26.58,11.89 v1(26.98,11.89) ; 28.6,30.79 28.61,30.78 v1(28.61,29.57) ; 18.09,27.12 18.09,27.87 17.96,28 15.4,28 15.25,28.15 v1(15.25,28.81) 15.25,30.6 C8.1 16.62,32.07 R3.2 ; 18.09,27.12 EN.1 ; 18.09,27.12 v1(18.09,26.02)
  Inner2 w0.127: v1(26.98,25.41) v1(26.98,11.89)
  Bottom Layer w0.254: v1(28.61,29.57) 28.61,27.08 26.98,25.46 v1(26.98,25.41) 18.7,25.41 v1(18.09,26.02)
IO0: length 22.5
  Top Layer w0.127: Q1.3 30.44,32.09 v1(30.44,32.98) ; U1.23 28.52,18.95 29.32,18.95 30.39,20.02 30.39,25.1 30.89,25.61 33.74,25.61 34.08,25.95 IO0.1 34.09,27.12 v1(34.09,28.2)
  Bottom Layer w0.254: v1(34.09,28.2) 34.09,32.01 33.13,32.98 v1(30.44,32.98)
IO2: length 38.9
  Top Layer w0.127: v1(30.99,23.93) 30.99,20.07 29.39,18.47 U1.22
  Bottom Layer w0.254: 2.92,33.04 4.05,31.91 9.86,31.91 17.84,23.93 v1(30.99,23.93)
IO4: length 37.3
  Top Layer w0.127: U1.24 29.22,19.47 29.52,19.77 v1(29.52,24.49)
  Bottom Layer w0.254: 7,40.11 8.9,38.21 8.9,33.99 18.4,24.49 v1(29.52,24.49)
IO12: length 19.2
  Top Layer w0.127: v1(30.94,15.96) 30.43,16.47 U1.18
  Bottom Layer w0.254: 47.08,16.96 46.08,15.96 v1(30.94,15.96)
IO13: length 23.1
  Top Layer w0.127: U1.20 29.61,17.47 v1(30.03,17.89)
  Bottom Layer w0.254: v1(30.03,17.89) 38.67,17.89 45.78,25 48.5,25
IO14: length 17
  Top Layer w0.127: v1(29.32,15.96) 29.31,15.97 U1.17
  Bottom Layer w0.254: 43,9.89 37.6,15.3 30.84,15.3 30.18,15.96 v1(29.32,15.96)
IO15: length 28.9
  Top Layer w0.127: U1.21 29.32,17.97
  Bottom Layer w0.254: 47.08,33.04 45.59,33.04 42.11,29.56 42.11,22.6 38.56,19.06 30.39,19.06 v1(29.32,17.99)
IO21: length 3.5
  Top Layer w0.127: U1.42 19.61,16.97 19.26,16.62 18.13,16.62
IO22: length 3.6
  Top Layer w0.127: U1.39 19.44,18.47 19.01,18.04 18.24,18.04 18.13,17.94
IO25: length 24.1
  Top Layer w0.127: U1.14 29.54,14.47 29.78,14.23 v1(29.78,12.96)
  Bottom Layer w0.254: 13.25,4.65 13.25,6.04 20.94,13.72 29.01,13.72 v1(29.78,12.96)
IO26: length 28.5
  Top Layer w0.127: v1(30.33,13.57) 30.33,14.59 29.95,14.97 U1.15
  Bottom Layer w0.254: 7,9.89 11.49,14.38 29.52,14.38 v1(30.33,13.57)
IO27: length 15.1
  Top Layer w0.127: U1.16 29.93,15.47
  Top Layer w0.254: 29.93,15.47 30.99,14.4 30.99,10.72 36.75,4.97 36.75,4.65
LIGHT_SENSOR: length 14.6
  Top Layer w0.127: U1.11 27.25,12.39 27.74,11.89 v1(28.76,11.89) ; 33.37,14.89 33.37,14.94 R15.2 ; 33.37,14.89 33.37,13.32 ; 33.37,14.89 34.65,14.89 34.91,14.64 34.91,12.15 34.65,11.89 33.33,11.89 33.28,11.94 ; 33.37,14.89 33.33,14.89
  Bottom Layer w0.127: v1(28.76,11.89) v1(33.23,11.89)
NEOPIX: length 7.7
  Top Layer w0.127: LED2.4 27.47,26.47 26.22,26.47 25.75,26 U1.29
NEOPIX_PWR: length 7.9
  Top Layer w0.254: LED2.1 23.7,26.5 24.04,26.17 24.04,22.1 23.25,21.32 U1.34
RTS: length 16.8
  Top Layer w0.127: 23.48,34.14 v1(23.38,34.14) 22.61,34.14 21.99,33.52 U2.13 ; Q1.1 30.44,29.27 30.18,29.01 25.81,29.01 25.66,29.17 v1(25.66,29.57) 25.66,30.6
  Bottom Layer w0.127: v1(23.38,34.14) 24.9,34.14 25.66,33.38 v1(25.66,29.57)
RX: length 14.2
  Top Layer w0.127: v1(20.48,28.61) 20.48,29.89 U2.5 ; U1.41 21.49,17.48 v1(20.48,17.48)
  Inner2 w0.127: v1(20.48,28.61) 20.48,26.07 arc(20.52,25.98) 20.61,25.94 20.86,25.94 arc(20.99,25.81) 20.86,25.69 20.61,25.69 arc(20.52,25.65) 20.48,25.56 v1(20.48,17.48)
SCL: length 26.1
  Top Layer w0.127: U3.13 34.4,18.8 34.25,18.95 34.25,19.61 34.14,19.72 R1.1 v1(33.37,20.68) ; v1(21.04,20.02) 20.73,20.33 15.04,20.33 14.8,20.08 U4.4 15.23,19.68 15.5,19.41 15.5,18.24 15.68,18.07 16.5,18.07 16.63,17.94
  Bottom Layer w0.127: v1(21.04,20.02) 32.71,20.02 v1(33.37,20.68)
SCL1: length 21.2
  Top Layer w0.254: 4,25 4.68,25 8.19,21.49 22.21,21.49 22.75,20.95 U1.35
SDA: length 29.4
  Top Layer w0.127: 33.53,18.3 U3.14 ; 33.53,18.3 33.47,18.3 33.37,18.4 ; 33.53,18.3 33.58,18.34 ; 33.53,18.3 33.42,18.19 32.77,18.19 32.62,18.34 v1(32.62,20.63) ; 16.63,16.62 15.65,16.62 15.27,17 15.27,18.83 15.04,19.06 14.31,19.06 14.13,19.23 14.13,19.66 U4.3 14.15,20.3 14.46,20.61 v1(21.42,20.61)
  Bottom Layer w0.127: v1(32.62,20.63) 32.59,20.61 v1(21.42,20.61)
SDA1: length 19.9
  Top Layer w0.254: 4.56,17.56 4.66,17.56 8.23,21.14 22,21.14 22.25,20.88 U1.36
TX: length 14.3
  Top Layer w0.127: v1(19.77,29.06) 19.77,30.58 ; U1.40 v1(19.77,17.97)
  Inner2 w0.127: v1(19.77,17.97) v1(19.77,29.06)
$1N15628: length 3.5
  Top Layer w0.127: 25.66,32.1 25.66,31.55 25.78,31.44 28.6,31.44
$1N15680: length 7.6
  Top Layer w0.127: Q1.2 30.45,31.45 v1(31.2,31.45) ; R9.2 v1(26.99,29.57)
  Bottom Layer w0.254: v1(31.2,31.45) 27.49,31.45 26.99,30.96 v1(26.99,29.57)
$1N17086: length 10.4
  Top Layer w0.254: 22.3,3 22.75,3.45 U1.2
$1N22484: length 6
  Top Layer w0.127: R13.2 32.06,33.89 31.86,34.09 29.27,34.09 29.09,34.27 29.09,35.42
$1N22485: length 1.5
  Top Layer w0.127: 33.49,30.65 33.44,30.7 R13.1
$1N22486: length 13.2
  Top Layer w0.127: v1(34.91,33.13) R14.1 ; U5.5 v1(29.09,39.02)
  Bottom Layer w0.127: v1(34.91,33.13) 34.91,38.21 34.09,39.02 v1(29.09,39.02)

## Copper pours and planes (outline as drawn; the poured copper is in the pictures)
3V3 on Top Layer: 23.12,39.63 25,39.63 25,38.11 23.12,38.11
3V3 on Inner2: outline of 160 points within 0.93,0.93 49.07,49.07
GND on Top Layer: outline of 184 points within -8.7,-8.7 58.7,58.7
GND on Bottom Layer: outline of 184 points within -7.2,-7.2 57.2,57.2
GND on Inner1: outline of 176 points within -3.82,-3.82 53.82,53.82

Small or netless copper shapes (teardrops, artwork), in the pictures only: 228 on Top Layer, 57 on Bottom Layer, 10 on Inner2

## Text on the board
Bottom Silkscreen Layer: JLCJLCJLCJLC | - | + | BAT
Top Silkscreen Layer: - | BAT | + | A10 | GND | 5V | 3V3 | A0 | A1 | A2 | A3 | A4 | A5 | A6 | A7 | A8 | A9
